# EAGLE design craw (EAGLE 9.3.2)
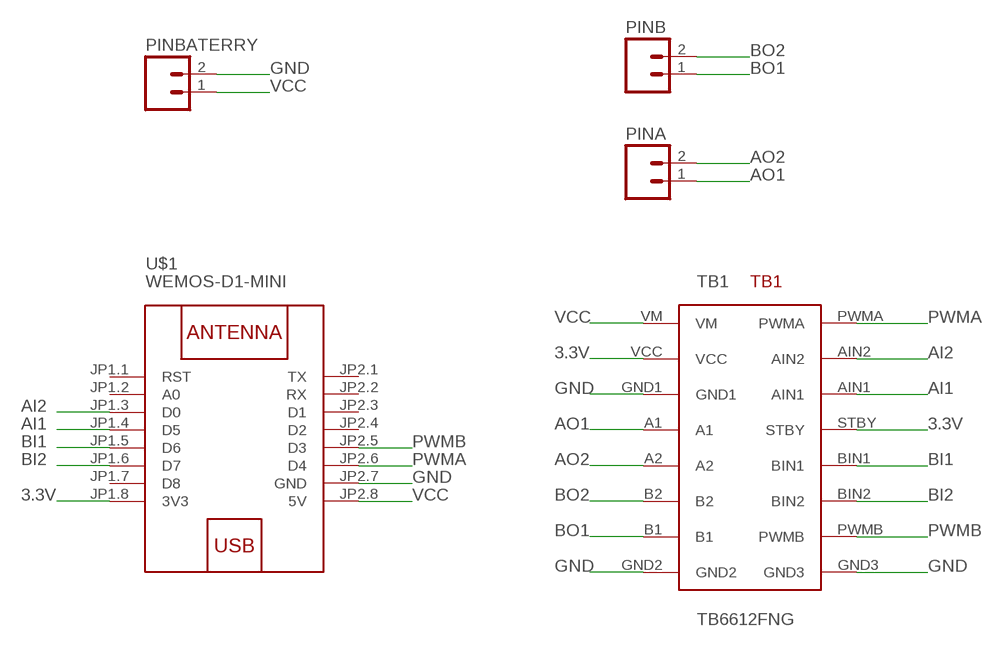
[diagram p0: schematic, sheet 1]

## Parts
PINA  M02  [02P]
PINB  M02  [02P]
PINBATERRY  M02  [02P]
TB1  TB6612FNG  [TB6612FNG]
U$1  WEMOS-D1-MINI  [WEMOS-D1-MINI]

## Nets
3.3V: TB1.STBY TB1.VCC U$1.JP1.8(3V3)
AI1: TB1.AIN1 U$1.JP1.4(D5)
AI2: TB1.AIN2 U$1.JP1.3(D0)
AO1: PINA.1 TB1.A1
AO2: PINA.2 TB1.A2
BI1: TB1.BIN1 U$1.JP1.5(D6)
BI2: TB1.BIN2 U$1.JP1.6(D7)
BO1: PINB.1 TB1.B1
BO2: PINB.2 TB1.B2
GND: PINBATERRY.2 TB1.GND1 TB1.GND2 TB1.GND3 U$1.JP2.7(GND)
PWMA: TB1.PWMA U$1.JP2.6(D4)
PWMB: TB1.PWMB U$1.JP2.5(D3)
VCC: PINBATERRY.1 TB1.VM U$1.JP2.8(5V)
Unconnected: U$1.JP1.1(RST) U$1.JP1.2(A0) U$1.JP1.7(D8) U$1.JP2.1(TX) U$1.JP2.2(RX) U$1.JP2.3(D1) U$1.JP2.4(D2)

## Library data of the parts
PINA PINB PINBATERRY = con-amp-quick:M02: AMP QUICK CONNECTOR; OC_FARNELL: unknown; OC_NEWARK: unknown
TB1 = TB6612FNG:TB6612FNG
U$1 = diy-modules:WEMOS-D1-MINI: WEMOS D1 mini: Mini Wi-Fi Board based on ESP-8266 device More details can be found here: https://www.wemos.cc/product/d1-mini.html Click here to find device on ebay.com <http://www.ebay.com/sch/wemos+d1+mini+nodemcu>

## Board
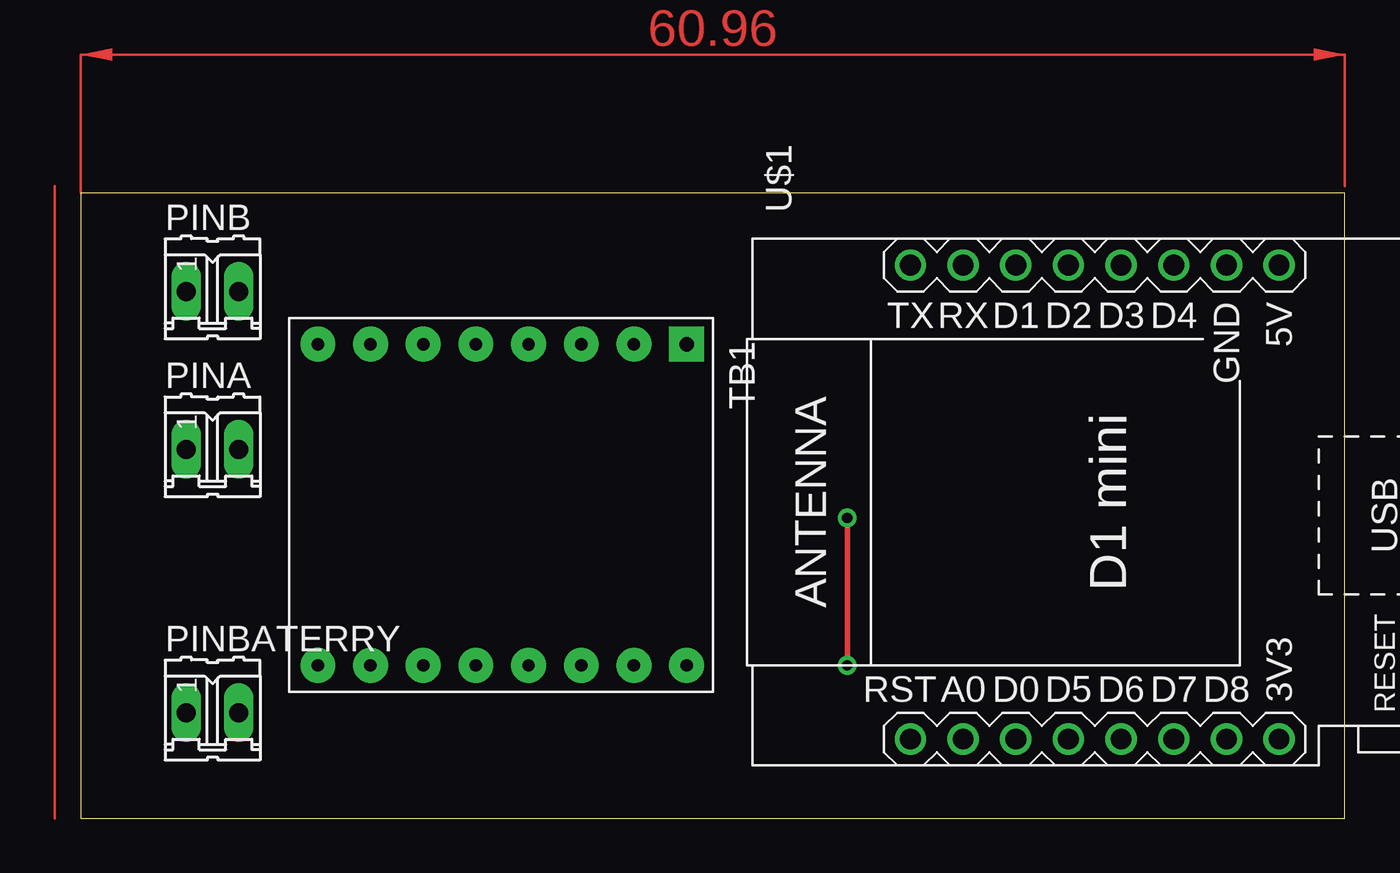
[diagram p1: board, top side]
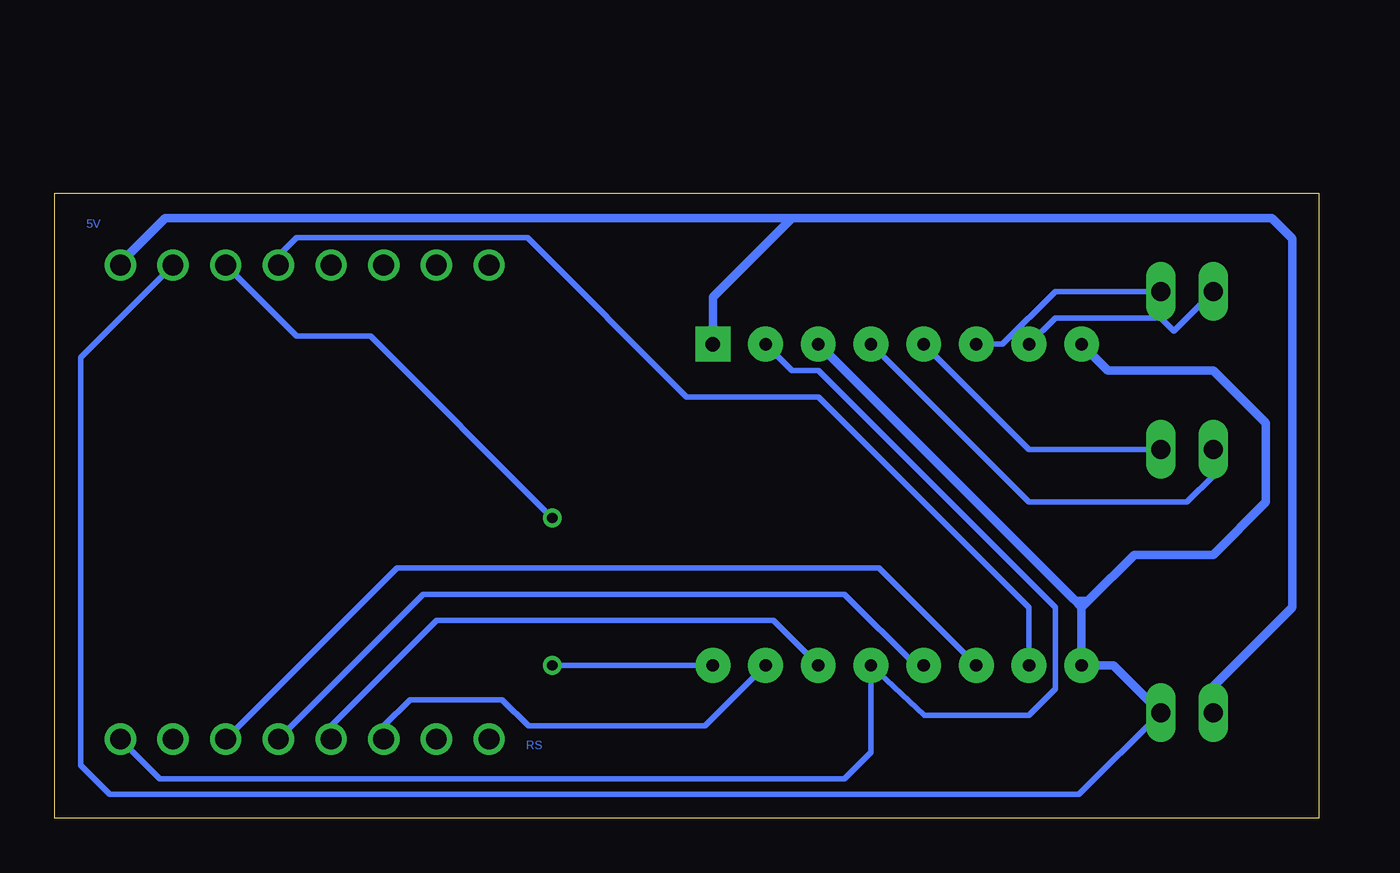
[diagram p2: board, bottom side, seen from below]

Size 60.94 x 30.15 mm. Coordinates in mm from the lower left corner, seen from the top.
Outline: 0,0 60.94,0 60.94,30.15 0,30.15 0,0
Copper layers (1*16): Top 0.035mm / dielectric 1.5mm / Bottom 0.035mm
Design rules "default": minimum track width 6mil, minimum drill 0.35mm, track to track 6mil, track to pad 6mil, pad to pad 6mil, via to via 6mil, smd to smd 6mil, copper to edge 40mil, drill to drill 6mil, minimum pad ring 10mil, minimum via ring 8mil, stop-mask expansion 4mil, vias tented up to drill 0mil, thermal gap 10mil

### Footprints (pad centres in the part's own frame; a part is rotated, then mirrored left to right if it is on the bottom)
02P = drill 0.914 long: 1 -1.27,0; 2 1.27,0
TB6612FNG = drill 0.6 pad 1.676: A1 -7.62,-1.27; A2 -7.62,-3.81; AIN1 7.874,1.27; AIN2 7.874,3.81; B1 -7.62,-8.89; B2 -7.62,-6.35; BIN1 7.874,-3.81; BIN2 7.874,-6.35; GND1 -7.62,1.27; GND2 -7.62,-11.43; GND3 7.874,-11.43; PWMA 7.874,6.35; PWMB 7.874,-8.89; STBY 7.874,-1.27; VCC -7.62,3.81 | drill 0.7 pad 1.676 square: VM -7.62,6.35
WEMOS-D1-MINI = drill 1: JP1.1 -11.43,9.525; JP1.2 -11.43,6.985; JP1.3 -11.43,4.445; JP1.4 -11.43,1.905; JP1.5 -11.43,-0.635; JP1.6 -11.43,-3.175; JP1.7 -11.43,-5.715; JP1.8 -11.43,-8.255; JP2.1 11.43,9.525; JP2.2 11.43,6.985; JP2.3 11.43,4.445; JP2.4 11.43,1.905; JP2.5 11.43,-0.635; JP2.6 11.43,-3.175; JP2.7 11.43,-5.715; JP2.8 11.43,-8.255

### Placement (x,y rotation side)
PINA  6.35,17.78 0 top
PINB  6.35,25.4 0 top
PINBATERRY  6.35,5.08 0 top
TB1  22.86,15.24 270 top
U$1  49.53,15.24 90 top

### Tracks (layer width: path | path; a pad name or v marks a point on that pad's centre or on a via)
3.3V
  Bottom 0.254: TB1.VCC 25.4,21.59 24.13,21.59 12.7,10.16 12.7,6.22 13.97,4.95 19,4.95 TB1.STBY 21.59,3.18 22.86,1.91 55.88,1.91 U$1.JP1.8
AI1
  Bottom 0.254: TB1.AIN1 26.29,9.53 42.55,9.53 47.62,4.45 U$1.JP1.4
AI2
  Bottom 0.254: TB1.AIN2 29.59,4.45 38.1,4.45 39.37,5.72 43.81,5.72 45.09,4.45 U$1.JP1.3
AO1
  Bottom 0.254: PINA.1 5.08,16.51 6.35,15.24 13.97,15.24 16.51,17.78 TB1.A1
AO2
  Bottom 0.254: PINA.2 13.97,17.78 TB1.A2
BI1
  Bottom 0.254: TB1.BIN1 19.43,7.37 22.86,10.8 43.18,10.8 U$1.JP1.5
BI2
  Bottom 0.254: TB1.BIN2 21.21,12.07 44.45,12.07 U$1.JP1.6
BO1
  Bottom 0.254: PINB.1 6.99,23.5 7.62,24.13 12.7,24.13 TB1.B1
BO2
  Bottom 0.254: PINB.2 12.7,25.4 15.24,22.86 TB1.B2
GND
  Bottom 0.254: 11.05,10.54 11.81,10.54 | U$1.JP2.7 59.69,22.23 59.69,2.54 58.29,1.14 11.56,1.14 PINBATERRY.2
  Bottom 0.406: PINBATERRY.2 9.91,7.37 TB1.GND3 11.43,10.16 | 11.43,10.16 11.05,10.54 8.89,12.7 5.08,12.7 2.54,15.24 2.54,19.05 5.08,21.59 10.16,21.59 TB1.GND2 | 11.43,10.16 11.81,10.54 TB1.GND1
PWMA  (via drill 0.5)
  Top 0.254: v36.96,7.37 v36.96,14.48
  Bottom 0.254: TB1.PWMA v36.96,7.37 | v36.96,14.48 45.72,23.24 49.28,23.24 U$1.JP2.6
PWMB
  Bottom 0.254: TB1.PWMB 13.97,10.16 24.13,20.32 30.48,20.32 38.15,27.99 49.28,27.99 50.16,27.1 U$1.JP2.5
VCC
  Bottom 0.406: 25.4,28.93 25.15,28.93 2.26,28.93 1.27,27.94 1.27,10.16 5.08,6.35 PINBATERRY.1 | TB1.VM 29.21,25.12 25.4,28.93 | U$1.JP2.8 57.78,26.77 55.63,28.93 37.34,28.93 25.4,28.93
(copper drawn outside any net)
  shapes: Top area x2

### Text on the board
Bottom: 5V | RS